# Altium schematic sheet ЦТЕА4.324.039_Э3_2.SchDoc
size 420 x 297 mm; ApprovedBy: Соколов; CheckedBy: Крушинская; DrawnBy: Бунтов; DocumentNumber: ЦТЕА4.324.039 Э3; SheetNumber: 2; SheetTotal: 3; Title1str: Плата управления; Title2str: и индикации телеметрии; ProcessInspection: Кудряшова; DocumentType1str: Схема электрическая; DocumentType2str: принципиальная; PageSetup: Record=PageOptionsZCenterHorizontal=TrueZCenterVertical=TrueZPrintScale=0.94ZXCorrection=1.00ZYCorrection=1.00ZPrintKind=1ZBorderSize=5000000ZLeftOffset=0ZBottomOffset=0ZOrientation=1ZPaperLength=1000ZPaperWidth=1000ZScale=100ZPaperSource=7ZPrintQuality=-4ZMediaType=1ZDitherType=10ZPaperKind=A4ZPrintScaleMode=1; ImagePath: ЦТЕА4.324.039; Rule: PcbType=ProtelPcb
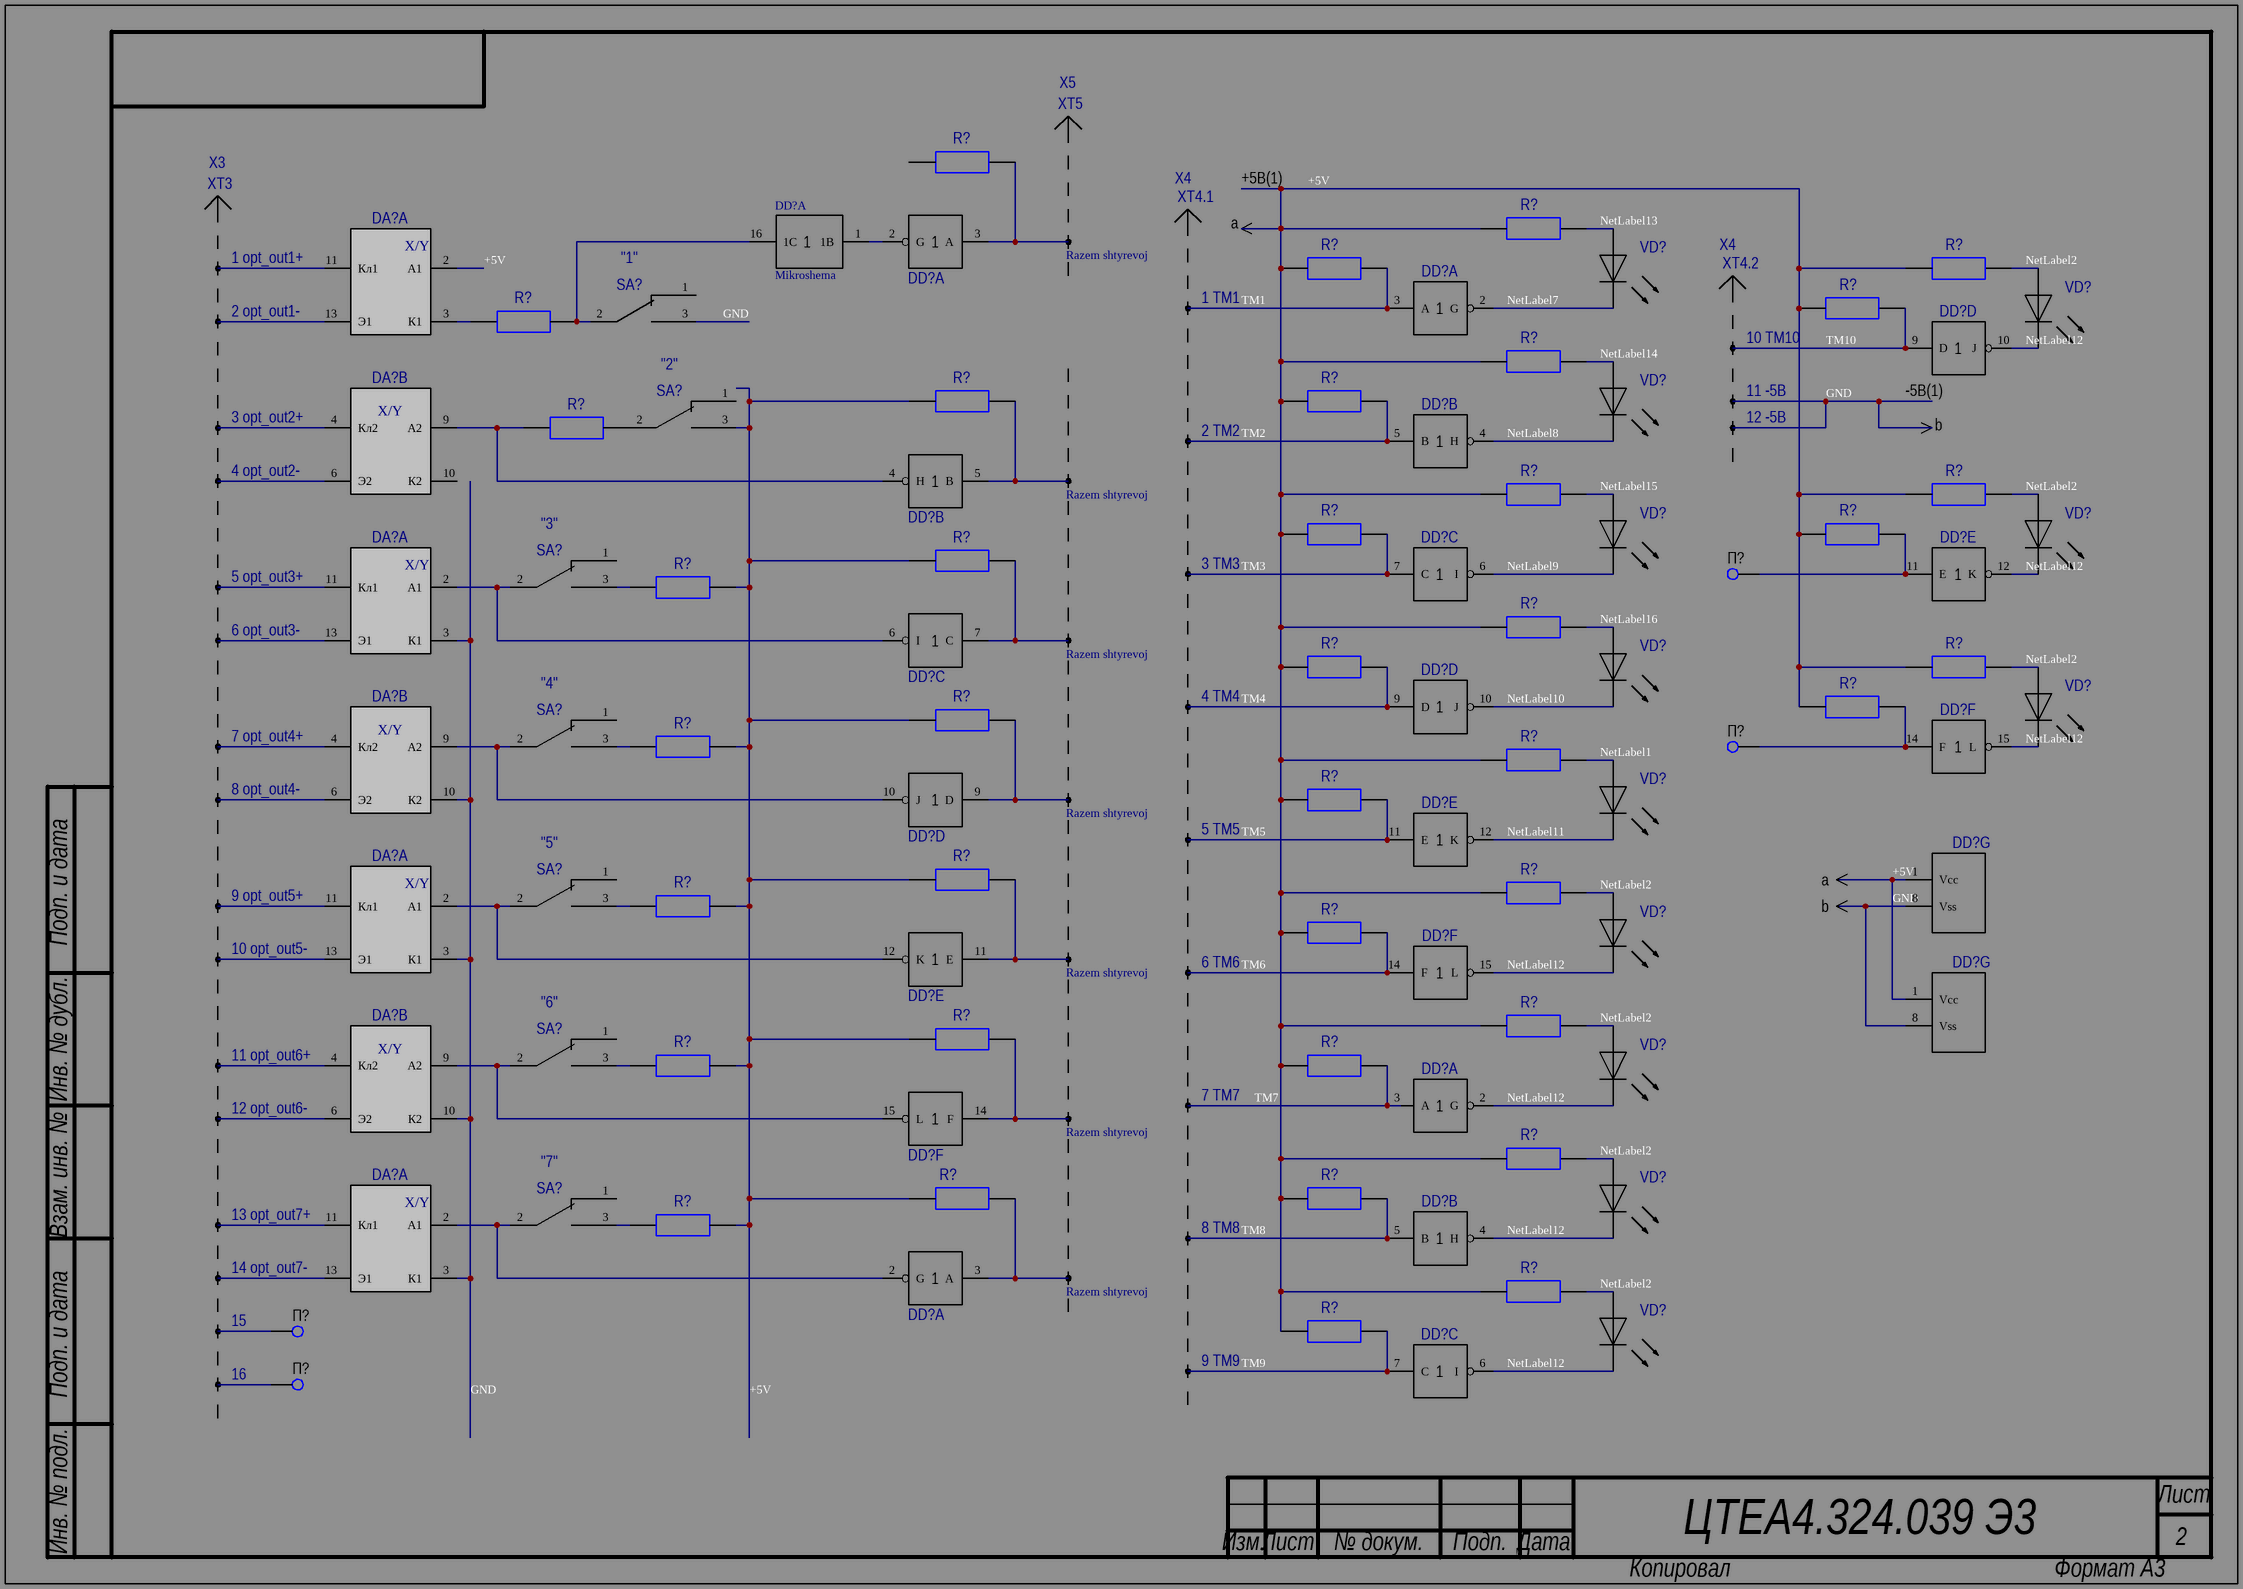
[diagram p0: ЦТЕА4.324.039_Э3_2.SchDoc]

## Parts
(Parts that share a designator on the sheet are numbered #1, #2 ... from top to bottom, then left to right.)
DA?#1  249КП1С  [249KP1S-44_3208_125_12]  (value not drawn)  (part A of 2)
DA?#2  249КП1С  [249KP1S-44_3208_125_12]  (value not drawn)  (part B of 2)
DA?#3  249КП1С  [249KP1S-44_3208_125_12]  (value not drawn)  (part A of 2)
DA?#4  249КП1С  [249KP1S-44_3208_125_12]  (value not drawn)  (part B of 2)
DA?#5  249КП1С  [249KP1S-44_3208_125_12]  (value not drawn)  (part A of 2)
DA?#6  249КП1С  [249KP1S-44_3208_125_12]  (value not drawn)  (part B of 2)
DA?#7  249КП1С  [249KP1S-44_3208_125_12]  (value not drawn)  (part A of 2)
DD?#1  Mikroshema  (part A of 8)
DD?#2  CD4049  [CD4049UBD]  (value not drawn)  (part A of 7)
DD?#3  CD4049  [CD4049UBD]  (value not drawn)  (part A of 7)
DD?#4  CD4049  [CD4049UBD]  (value not drawn)  (part D of 7)
DD?#5  CD4049  [CD4049UBD]  (value not drawn)  (part B of 7)
DD?#6  CD4049  [CD4049UBD]  (value not drawn)  (part B of 7)
DD?#7  CD4049  [CD4049UBD]  (value not drawn)  (part C of 7)
DD?#8  CD4049  [CD4049UBD]  (value not drawn)  (part E of 7)
DD?#9  CD4049  [CD4049UBD]  (value not drawn)  (part C of 7)
DD?#10  CD4049  [CD4049UBD]  (value not drawn)  (part D of 7)
DD?#11  CD4049  [CD4049UBD]  (value not drawn)  (part F of 7)
DD?#12  CD4049  [CD4049UBD]  (value not drawn)  (part D of 7)
DD?#13  CD4049  [CD4049UBD]  (value not drawn)  (part E of 7)
DD?#14  (no value)  [CD4049UBD]  (part G of 7)
DD?#15  CD4049  [CD4049UBD]  (value not drawn)  (part E of 7)
DD?#16  CD4049  [CD4049UBD]  (value not drawn)  (part F of 7)
DD?#17  (no value)  [CD4049UBD]  (part G of 7)
DD?#18  CD4049  [CD4049UBD]  (value not drawn)  (part A of 7)
DD?#19  CD4049  [CD4049UBD]  (value not drawn)  (part F of 7)
DD?#20  CD4049  [CD4049UBD]  (value not drawn)  (part B of 7)
DD?#21  CD4049  [CD4049UBD]  (value not drawn)  (part A of 7)
DD?#22  CD4049  [CD4049UBD]  (value not drawn)  (part C of 7)
R?#1  Res  [R1-12_0_25_3_3_kOm-d5]  (value not drawn)
R?#2  Res  [R1-12_0_25_470_Om-d5]  (value not drawn)
R?#3  Res  [R1-12_0_25_3_3_kOm-d5]  (value not drawn)
R?#4  Res  [R1-12_0_25_470_Om-d5]  (value not drawn)
R?#5  Res  [R1-12_0_25_3_3_kOm-d5]  (value not drawn)
R?#6  Res  [R1-12_0_25_300_Om-d5]  (value not drawn)
R?#7  Res  [R1-12_0_25_470_Om-d5]  (value not drawn)
R?#8  Res  [R1-12_0_25_3_3_kOm-d5]  (value not drawn)
R?#9  Res  [R1-12_0_25_3_3_kOm-d5]  (value not drawn)
R?#10  Res  [R1-12_0_25_300_Om-d5]  (value not drawn)
R?#11  Res  [R1-12_0_25_470_Om-d5]  (value not drawn)
R?#12  Res  [R1-12_0_25_470_Om-d5]  (value not drawn)
R?#13  Res  [R1-12_0_25_3_3_kOm-d5]  (value not drawn)
R?#14  Res  [R1-12_0_25_3_3_kOm-d5]  (value not drawn)
R?#15  Res  [R1-12_0_25_3_3_kOm-d5]  (value not drawn)
R?#16  Res  [R1-12_0_25_300_Om-d5]  (value not drawn)
R?#17  Res  [R1-12_0_25_470_Om-d5]  (value not drawn)
R?#18  Res  [R1-12_0_25_3_3_kOm-d5]  (value not drawn)
R?#19  Res  [R1-12_0_25_470_Om-d5]  (value not drawn)
R?#20  Res  [R1-12_0_25_3_3_kOm-d5]  (value not drawn)
R?#21  Res  [R1-12_0_25_3_3_kOm-d5]  (value not drawn)
R?#22  Res  [R1-12_0_25_300_Om-d5]  (value not drawn)
R?#23  Res  [R1-12_0_25_470_Om-d5]  (value not drawn)
R?#24  Res  [R1-12_0_25_3_3_kOm-d5]  (value not drawn)
R?#25  Res  [R1-12_0_25_3_3_kOm-d5]  (value not drawn)
R?#26  Res  [R1-12_0_25_470_Om-d5]  (value not drawn)
R?#27  Res  [R1-12_0_25_300_Om-d5]  (value not drawn)
R?#28  Res  [R1-12_0_25_3_3_kOm-d5]  (value not drawn)
R?#29  Res  [R1-12_0_25_470_Om-d5]  (value not drawn)
R?#30  Res  [R1-12_0_25_3_3_kOm-d5]  (value not drawn)
R?#31  Res  [R1-12_0_25_300_Om-d5]  (value not drawn)
R?#32  Res  [R1-12_0_25_3_3_kOm-d5]  (value not drawn)
R?#33  Res  [R1-12_0_25_470_Om-d5]  (value not drawn)
R?#34  Res  [R1-12_0_25_3_3_kOm-d5]  (value not drawn)
R?#35  Res  [R1-12_0_25_3_3_kOm-d5]  (value not drawn)
R?#36  Res  [R1-12_0_25_300_Om-d5]  (value not drawn)
R?#37  Res  [R1-12_0_25_470_Om-d5]  (value not drawn)
R?#38  Res  [R1-12_0_25_3_3_kOm-d5]  (value not drawn)
SA?#1  "1"  [7107SYZQE]
SA?#2  "2"  [7107SYZQE]
SA?#3  "3"  [7107SYZQE]
SA?#4  "4"  [7107SYZQE]
SA?#5  "5"  [7107SYZQE]
SA?#6  "6"  [7107SYZQE]
SA?#7  "7"  [7107SYZQE]
VD?#1  LED  [HLMP-D150]  (value not drawn)
VD?#2  LED  [HLMP-D150]  (value not drawn)
VD?#3  LED  [HLMP-D150]  (value not drawn)
VD?#4  LED  [HLMP-D150]  (value not drawn)
VD?#5  LED  [HLMP-D150]  (value not drawn)
VD?#6  LED  [HLMP-D150]  (value not drawn)
VD?#7  LED  [HLMP-D150]  (value not drawn)
VD?#8  LED  [HLMP-D150]  (value not drawn)
VD?#9  LED  [HLMP-D150]  (value not drawn)
VD?#10  LED  [HLMP-D150]  (value not drawn)
VD?#11  LED  [HLMP-D150]  (value not drawn)
VD?#12  LED  [HLMP-D150]  (value not drawn)
XT?#1  Razem shtyrevoj  [PLD-20]  (part S of 20)
XT?#2  1 opt_out1+  [PLD-18]  (part K of 18)
XT?#3  1 ТМ1  [PLD-16]  (part A of 16)
XT?#4  2 opt_out1-  [PLD-18]  (part L of 18)
XT?#5  10 ТМ10  [PLD-16]  (part J of 16)
XT?#6  11 -5В  [PLD-16]  (part K of 16)
XT?#7  3 opt_out2+  [PLD-18]  (part M of 18)
XT?#8  12 -5В  [PLD-16]  (part L of 16)
XT?#9  2 ТМ2  [PLD-16]  (part B of 16)
XT?#10  4 opt_out2-  [PLD-18]  (part N of 18)
XT?#11  Razem shtyrevoj  [PLD-20]  (part T of 20)
XT?#12  3 ТМ3  [PLD-16]  (part C of 16)
XT?#13  5 opt_out3+  [PLD-18]  (part O of 18)
XT?#14  6 opt_out3-  [PLD-18]  (part P of 18)
XT?#15  Razem shtyrevoj  [PLD-20]  (part I of 20)
XT?#16  4 ТМ4  [PLD-16]  (part D of 16)
XT?#17  7 opt_out4+  [PLD-18]  (part Q of 18)
XT?#18  8 opt_out4-  [PLD-18]  (part R of 18)
XT?#19  Razem shtyrevoj  [PLD-20]  (part J of 20)
XT?#20  5 ТМ5  [PLD-16]  (part E of 16)
XT?#21  9 opt_out5+  [PLD-18]  (part A of 18)
XT?#22  10 opt_out5-  [PLD-18]  (part B of 18)
XT?#23  Razem shtyrevoj  [PLD-20]  (part K of 20)
XT?#24  6 ТМ6  [PLD-16]  (part F of 16)
XT?#25  11 opt_out6+  [PLD-18]  (part C of 18)
XT?#26  7 ТМ7  [PLD-16]  (part G of 16)
XT?#27  12 opt_out6-  [PLD-18]  (part D of 18)
XT?#28  Razem shtyrevoj  [PLD-20]  (part L of 20)
XT?#29  13 opt_out7+  [PLD-18]  (part E of 18)
XT?#30  8 ТМ8  [PLD-16]  (part H of 16)
XT?#31  14 opt_out7-  [PLD-18]  (part F of 18)
XT?#32  Razem shtyrevoj  [PLD-20]  (part M of 20)
XT?#33  15  [PLD-18]  (part G of 18)
XT?#34  9 ТМ9  [PLD-16]  (part I of 16)
XT?#35  16  [PLD-18]  (part H of 18)
П?#1  (no value)  [Pad]
П?#2  (no value)  [Pad]
П?#3  (no value)  [Pad]
П?#4  (no value)  [Pad]

## Nets
+5V: DA?#1.2(А1) DA?#3.3(К1) DA?#4.10(К2) DA?#5.3(К1) DA?#6.10(К2) DA?#7.3(К1) DD?#14.1(Vcc) DD?#14.8(Vss) DD?#17.1(Vcc) DD?#17.8(Vss) R?#2.2 R?#3.2 R?#4.2 R?#5.2 R?#7.2 R?#8.2 R?#9.2 R?#11.2 R?#12.2 R?#13.2 R?#14.2 R?#15.2 R?#16.2 R?#17.2 R?#18.2 R?#19.2 R?#20.2 R?#21.2 R?#22.2 R?#23.2 R?#24.2 R?#25.2 R?#26.2 R?#27.2 R?#28.2 R?#29.2 R?#30.2 R?#31.2 R?#32.2 R?#33.2 R?#34.2 R?#35.2 R?#36.2 R?#37.2 R?#38.2 SA?#1.3 SA?#2.3 XT?#6.11 XT?#8.12  [also labelled GND]
NetLabel1: R?#23.1 VD?#8.1(A)
NetLabel2: R?#4.1 R?#12.1 R?#19.1 R?#26.1 R?#29.1 R?#33.1 R?#37.1 VD?#2.1(A) VD?#5.1(A) VD?#7.1(A) VD?#9.1(A) VD?#10.1(A) VD?#11.1(A) VD?#12.1(A)
NetLabel7: DD?#3.2(G) VD?#1.2(C)
NetLabel8: DD?#5.4(H) VD?#3.2(C)
NetLabel9: DD?#7.6(I) VD?#4.2(C)
NetLabel10: DD?#10.10(J) VD?#6.2(C)
NetLabel11: DD?#13.12(K) VD?#8.2(C)
NetLabel12: DD?#4.10(J) DD?#8.12(K) DD?#11.15(L) DD?#16.15(L) DD?#18.2(G) DD?#20.4(H) DD?#22.6(I) VD?#2.2(C) VD?#5.2(C) VD?#7.2(C) VD?#9.2(C) VD?#10.2(C) VD?#11.2(C) VD?#12.2(C)
NetLabel13: R?#2.1 VD?#1.1(A)
NetLabel14: R?#7.1 VD?#3.1(A)
NetLabel15: R?#11.1 VD?#4.1(A)
NetLabel16: R?#17.1 VD?#6.1(A)
ТМ1: DD?#3.3(A) R?#3.1 XT?#3.1
ТМ2: DD?#5.5(B) R?#9.1 XT?#9.2
ТМ3: DD?#7.7(C) R?#13.1 XT?#12.3
ТМ4: DD?#10.9(D) R?#18.1 XT?#16.4
ТМ5: DD?#13.11(E) R?#24.1 XT?#20.5
ТМ6: DD?#16.14(F) R?#28.1 XT?#24.6
ТМ7: DD?#18.3(A) R?#32.1 XT?#26.7
ТМ8: DD?#20.5(B) R?#35.1 XT?#30.8
ТМ9: DD?#22.7(C) R?#38.1 XT?#34.9
ТМ10: DD?#4.9(D) R?#5.1 XT?#5.10
NetDA?#1_3: DA?#1.3(К1) R?#6.1
NetDA?#1_11: DA?#1.11(Кл1) XT?#2.11
NetDA?#1_13: DA?#1.13(Э1) XT?#4.12
NetDA?#2_4: DA?#2.4(Кл2) XT?#7.13
NetDA?#2_6: DA?#2.6(Э2) XT?#10.14
NetDA?#2_9: DA?#2.9(А2) DD?#6.4(H) R?#10.1
NetDA?#3_2: DA?#3.2(А1) DD?#9.6(I) SA?#3.2
NetDA?#3_11: DA?#3.11(Кл1) XT?#13.15
NetDA?#3_13: DA?#3.13(Э1) XT?#14.16
NetDA?#4_4: DA?#4.4(Кл2) XT?#17.17
NetDA?#4_6: DA?#4.6(Э2) XT?#18.18
NetDA?#4_9: DA?#4.9(А2) DD?#12.10(J) SA?#4.2
NetDA?#5_2: DA?#5.2(А1) DD?#15.12(K) SA?#5.2
NetDA?#5_11: DA?#5.11(Кл1) XT?#21.1
NetDA?#5_13: DA?#5.13(Э1) XT?#22.2
NetDA?#6_4: DA?#6.4(Кл2) XT?#25.3
NetDA?#6_6: DA?#6.6(Э2) XT?#27.4
NetDA?#6_9: DA?#6.9(А2) DD?#19.15(L) SA?#6.2
NetDA?#7_2: DA?#7.2(А1) DD?#21.2(G) SA?#7.2
NetDA?#7_11: DA?#7.11(Кл1) XT?#29.5
NetDA?#7_13: DA?#7.13(Э1) XT?#31.6
NetDD?#1_1: DD?#1.1(1B) DD?#2.2(G)
NetDD?#1_16: DD?#1.16(1C) R?#6.2 SA?#1.2
NetDD?#2_3: DD?#2.3(A) R?#1.1 XT?#1.19
NetDD?#6_5: DD?#6.5(B) R?#8.1 XT?#11.20
NetDD?#8_11: DD?#8.11(E) R?#14.1 П?#1.1
NetDD?#9_7: DD?#9.7(C) R?#15.1 XT?#15.9
NetDD?#11_14: DD?#11.14(F) R?#20.1 П?#2.1
NetDD?#12_9: DD?#12.9(D) R?#21.1 XT?#19.10
NetDD?#15_11: DD?#15.11(E) R?#25.1 XT?#23.11
NetDD?#19_14: DD?#19.14(F) R?#30.1 XT?#28.12
NetDD?#21_3: DD?#21.3(A) R?#34.1 XT?#32.13
NetR?#10_2: R?#10.2 SA?#2.2
NetR?#16_1: R?#16.1 SA?#3.3
NetR?#22_1: R?#22.1 SA?#4.3
NetR?#27_1: R?#27.1 SA?#5.3
NetR?#31_1: R?#31.1 SA?#6.3
NetR?#36_1: R?#36.1 SA?#7.3
NetXT?#33_7: XT?#33.7 П?#3.1
NetXT?#35_8: XT?#35.8 П?#4.1

Not connected (* = marked no-connect by the designer): DA?#2 10(К2); R?#1 2; SA?#1 1; SA?#2 1; SA?#3 1; SA?#4 1; SA?#5 1; SA?#6 1; SA?#7 1

## Notes on the sheet
- XT5
- X5
- XT3
- X3
- X4
- +5В(1)
- XT4.1
- а
- XT4.2
- (near DD?#4) -5В(1)
- b
- Подп. и дата
- Инв. № дубл.
- Взам. инв. №
- Инв. № подл.
- Лист
- Изм.
- № докум.
- Подп.
- Дата
- Копировал
- Формат А3
- (in symbol Microshema, part A) Х/Y
- (in symbol Microshema, part B) Х/Y

## Library data of the parts
DA?#1-DA?#7 = Microshema
DD?#1 = Mikroshema: CD4050BD
DD?#2-DD?#22 = Mikroshema
R?#1-R?#38 = Rezistor
SA?#1-SA?#7 = Perekljuchatel
VD?#1-VD?#12 = Svetodiod
XT?#2 XT?#4 XT?#7 XT?#10 XT?#13 XT?#14 XT?#17 XT?#18 XT?#21 XT?#22 XT?#25 XT?#27 XT?#29 XT?#31 XT?#33 XT?#35 = Razem shtyrevoj: Наименование: *; Название: *
XT?#3 XT?#5 XT?#6 XT?#8 XT?#9 XT?#12 XT?#16 XT?#20 XT?#24 XT?#26 XT?#30 XT?#34 = Razem shtyrevoj: PLD16; Наименование: *; Название: *
П?#1-П?#4 = Pad
XT?#1 XT?#11 XT?#15 XT?#19 XT?#23 XT?#28 XT?#32 = Razem shtyrevoj: Наименование: *; Название: *